# EAGLE design stageboy (EAGLE 6.5.0)
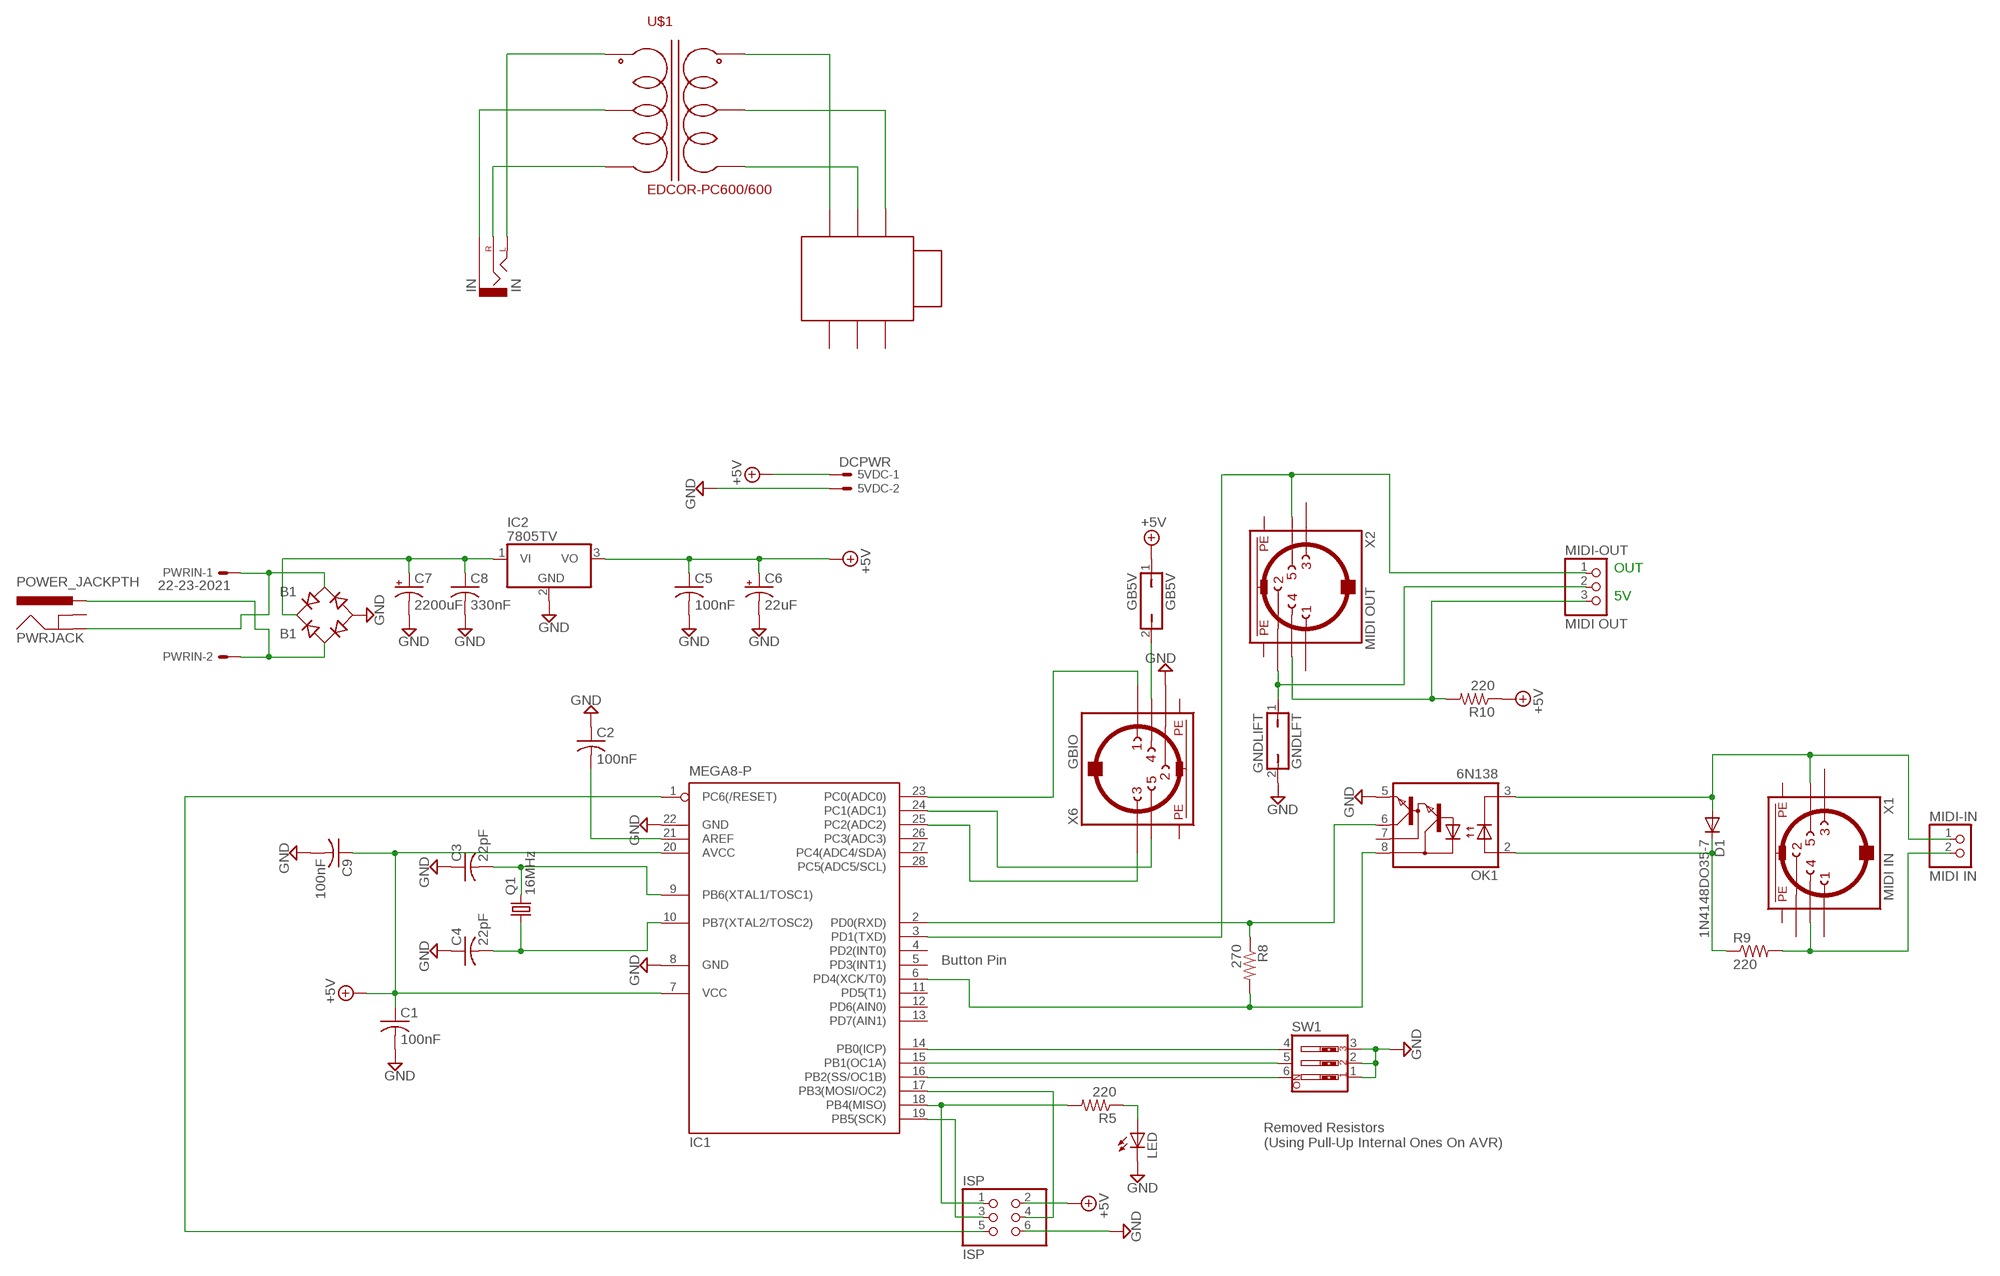
[diagram p0: schematic, sheet 1]

## Parts
5VDC  DCPWR  22-23-2021  [22-23-2021]
B1  B1  RB1A  [RB1A]
C1  100nF  C-US025-025X050  [C025-025X050]
C2  100nF  C-US025-025X050  [C025-025X050]
C3  22pF  C-US025-025X050  [C025-025X050]
C4  22pF  C-US025-025X050  [C025-025X050]
C5  100nF  C-US025-025X050  [C025-025X050]
C6  22uF  CPOL-USE2.5-5  [E2,5-5]
C7  2200uF  CPOL-USE5-13  [E5-13]
C8  330nF  C-US025-025X050  [C025-025X050]
C9  100nF  C-US025-025X050  [C025-025X050]
D1  1N4148DO35-7  [DO35-7]
GB5V  GB5V  JP1Q  [JP1]
GNDLFT  GNDLIFT  JP1Q  [JP1]
IC1  MEGA8-P  [DIL28-3]
IC2  7805TV  [TO220V]
IN  IN  AUDIO-JACKPTH  [AUDIO-JACK]
ISP  ISP  PINHD-2X3  [2X03]
LED  LED3MM  [LED3MM]
MIDI-IN  MIDI IN  PINHD-1X2  [1X02]
MIDI-OUT  MIDI OUT  PINHD-1X3  [1X03]
OK1  6N138  [DIL08]
OUT  NMJ6HFD2  [NMJ6HFD2]
PWRIN  22-23-2021  [22-23-2021]
PWRJACK  POWER_JACKPTH  [POWER_JACK_PTH]
Q1  16MHz  CRYSTALHC49S  [HC49/S]
R5  220  R-US_0204/7  [0204/7]
R8  270  R-US_0204/7  [0204/7]
R9  220  R-US_0204/7  [0204/7]
R10  220  R-US_0204/7  [0204/7]
SW1  SW_DIP-3  [EDG-03]
U$1  EDCOR-PC600/600  [PCW-12PIN]
X1  MIDI IN  MAB5SH  [MAB5SH]
X2  MIDI OUT  MAB5SH  [MAB5SH]
X6  GBIO  MAB5SH  [MAB5SH]

## Nets
+5V: 5VDC.1 C1.1 C5.1 C6.+ C9.1 GB5V.1 IC1.7(VCC) IC1.20(AVCC) IC2.3(VO) ISP.2 R10.1
GND: 5VDC.2 B1.- C1.2 C2.1 C3.1 C4.1 C5.2 C6.- C7.- C8.2 C9.2 GNDLFT.2 IC1.8(GND) IC1.22(GND) IC2.2(GND) ISP.6 LED.K(C) OK1.5(GND) SW1.1 SW1.2 SW1.3 X6.2
N$1: IC1.1(PC6(/RESET)) ISP.5
N$2: C2.2 IC1.21(AREF)
N$3: LED.A R5.1
N$4: IC1.14(PB0(ICP)) SW1.4
N$5: IC1.15(PB1(OC1A)) SW1.5
N$6: IC1.16(PB2(SS/OC1B)) SW1.6
N$10: IC1.6(PD4(XCK/T0)) OK1.8(VCC) R8.2
N$11: IC1.2(PD0(RXD)) OK1.6(VO) R8.1
N$12: D1.A MIDI-IN.1 OK1.3(C) X1.5
N$13: D1.C OK1.2(A) R9.1
N$16: MIDI-IN.2 R9.2 X1.4
N$17: IC1.17(PB3(MOSI/OC2)) ISP.4
N$18: IC1.18(PB4(MISO)) ISP.1 R5.2
N$19: IC1.19(PB5(SCK)) ISP.3
N$20: GB5V.2 X6.4
N$21: IC1.3(PD1(TXD)) MIDI-OUT.1 X2.5
N$22: C4.2 IC1.10(PB7(XTAL2/TOSC2)) Q1.1
N$23: IC1.25(PC2(ADC2)) X6.3
N$24: C3.2 IC1.9(PB6(XTAL1/TOSC1)) Q1.2
N$25: IC1.24(PC1(ADC1)) X6.5
N$26: IC1.23(PC0(ADC0)) X6.1
N$27: MIDI-OUT.3 R10.2 X2.4
N$28: B1.+ C7.+ C8.1 IC2.1(VI)
N$29: IN.TIP(LEFT) U$1.P$1
N$30: OUT.GND-IN U$1.P$8
N$32: OUT.LEFT-IN U$1.P$7
N$33: OUT.RIGHT-IN U$1.P$9
N$35: IN.SLEEVE U$1.P$2
N$38: B1.AC2 PWRIN.1 PWRJACK.GND
N$39: B1.AC1 PWRIN.2 PWRJACK.PWR
N$40: IN.RING(RIGHT) U$1.P$3
N$43: GNDLFT.1 MIDI-OUT.2 X2.2
Unconnected: IC1.4(PD2(INT0)) IC1.5(PD3(INT1)) IC1.11(PD5(T1)) IC1.12(PD6(AIN0)) IC1.13(PD7(AIN1)) IC1.26(PC3(ADC3)) IC1.27(PC4(ADC4/SDA)) IC1.28(PC5(ADC5/SCL)) OK1.7(VB) OUT.GND-OUT OUT.LEFT-OUT OUT.RIGHT-OUT PWRJACK.GNDBREAK X1.1 X1.2 X1.3 X2.1 X2.3

## Notes on the sheet
- OUT
- 5V
- Button Pin
- Removed Resistors
  (Using Pull-Up Internal Ones On AVR)

## Power pins joined to a net without a drawn wire
PE: X1.PE X1.PE@(PE) X2.PE X2.PE@(PE) X6.PE X6.PE@(PE)

## Library data of the parts
5VDC PWRIN = con-molex:22-23-2021: .100" (2.54mm) Center Header - 2 Pin; MF: MOLEX; MPN: 22-23-2021; OC_FARNELL: 1462926; OC_NEWARK: 25C3832
B1 = rectifier:RB1A: RECTIFIER 1 A
C1-C5 C8 C9 = rcl:C-US: CAPACITOR, American symbol
C6 C7 = resistor:CPOL-US: POLARIZED CAPACITOR, American symbol
D1 = diode:1N4148: DIODE high speed (Philips)
GB5V GNDLFT = jumper:JP1Q: JUMPER
IC1 = atmel:MEGA8-P: MICROCONTROLLER 8 Kbytes FLASH, 1 kbytes SRAM, 512 bytes EEPROM, USART, 4-channel 10 bit ADC, 2-channel 8 bit ADC Pin compatible with Atmega48, ATMega88, ATMega168 Source: avr.lbr; OC_FARNELL: unknown; OC_NEWARK: unknown
IC2 = linear:78*: Positive VOLTAGE REGULATOR Source: http://cache.national.com/ds/LM/LM78L05.pdf http://www.fairchildsemi.com/ds/LM/LM7805.pdf
IN = SparkFun:AUDIO-JACK: 3.5mm Audio Jack Simple 3.5mm common PCB mount audio jack. SKU: PRT-08032
ISP = pinhead:PINHD-2X3: PIN HEADER
LED = led:LED: LED OSRAM: - CHIPLED LG R971, LG N971, LY N971, LG Q971, LY Q971, LO R971, LY R971 LH N974, LH R974 LS Q976, LO Q976, LY Q976 LO Q996 - Hyper CHIPLED LW Q18S LB Q993, LB Q99A, LB R99A - SideLED LS A670, LO A670, LY A670, LG A670, LP A670 LB A673, LV A673, LT A673, LW A673 LH A674 LY A675 LS A676, LA A676, LO A676, LY A676, LW A676 LS A679, LY A679, LG A679 - Hyper Micro SIDELED® LS Y876, LA Y876, LO Y876, LY Y876 LT Y87S - SmartLED LW L88C, LW L88S LB L89C, LB L89S, LG L890 LS L89K, LO L89K, LY L89K LS L896, LA L896, LO L896, LY L896 - TOPLED LS T670, LO T670, LY T670, LG T670, LP T670 LSG T670, LSP T670, LSY T670, LOP T670, LYG T670 LG T671, LOG T671, LSG T671 LB T673, LV T673, LT T673, LW T673 LH T674 LS T676, LA T676, LO T676, LY T676, LB T676, LH T676, LSB T676, LW T676 LB T67C, LV T67C, LT T67C, LS T67K, LO T67K, LY T67K, LW E67C LS E67B, LA E67B, LO E67B, LY E67B, LB E67C, LV E67C, LT E67C LW T67C LS T679, LY T679, LG T679 LS T770, LO T770, LY T770, LG T770, LP T770 LB T773, LV T773, LT T773, LW T773 LH T774 LS E675, LA E675, LY E675, LS T675 LS T776, LA T776, LO T776, LY T776, LB T776 LHGB T686 LT T68C, LB T68C - Hyper Mini TOPLED® LB M676 - Mini TOPLED Santana® LG M470 LS M47K, LO M47K, LY M47K Source: http://www.osram.convergy.de LUXEON: - LUMILED® LXK2-PW12-R00, LXK2-PW12-S00, LXK2-PW14-U00, LXK2-PW14-V00 LXK2-PM12-R00, LXK2-PM12-S00, LXK2-PM14-U00 LXK2-PE12-Q00, LXK2-PE12-R00, LXK2-PE12-S00, LXK2-PE14-T00, LXK2-PE14-U00 LXK2-PB12-K00, LXK2-PB12-L00, LXK2-PB12-M00, LXK2-PB14-N00, LXK2-PB14-P00, LXK2-PB14-Q00 LXK2-PR12-L00, LXK2-PR12-M00, LXK2-PR14-Q00, LXK2-PR14-R00 LXK2-PD12-Q00, LXK2-PD12-R00, LXK2-PD12-S00 LXK2-PH12-R00, LXK2-PH12-S00 LXK2-PL12-P00, LXK2-PL12-Q00, LXK2-PL12-R00 Source: www.luxeon.com KINGBRIGHT: KA-3528ASYC Source: www.kingbright.com
MIDI-IN = pinhead:PINHD-1X2: PIN HEADER
MIDI-OUT = pinhead:PINHD-1X3: PIN HEADER
OK1 = optocoupler:6N138: MOTOROLA OPTO COUPLER; MF: VISHAY/TELEFUNKEN; MPN: 6N138; OC_FARNELL: 9860150; OC_NEWARK: 35K5294
OUT = Neutrik:NMJ6HFD2
PWRJACK = SparkFun-Connectors:POWER_JACK: Power Jack This is the standard 5.5mm barrel jack for power. The PTH is the most common, proven, reliable, footprint. The Slot footprint only works if the mill layer is transmitted to the PCB fab house so be warned. Spark Fun Electronics SKU : PRT-00119 SMT: CONN-08106 Mating wall wart : TOL-00298 (and others)
Q1 = crystal:CRYSTAL: CRYSTAL; OC_FARNELL: 1667008; OC_NEWARK: unknown
R5 R8-R10 = resistor:R-US_: RESISTOR, American symbol
SW1 = special:SW_DIP-3: DIP SWITCH
U$1 = EDCOR:EDCOR-PC600/600
X1 X2 X6 = con-hirschmann:MAB5SH: Female CONNECTOR 5 pins 90 deg. with shield, horizontal (DIN 41524); OC_FARNELL: 809883; OC_NEWARK: unknown

## Board
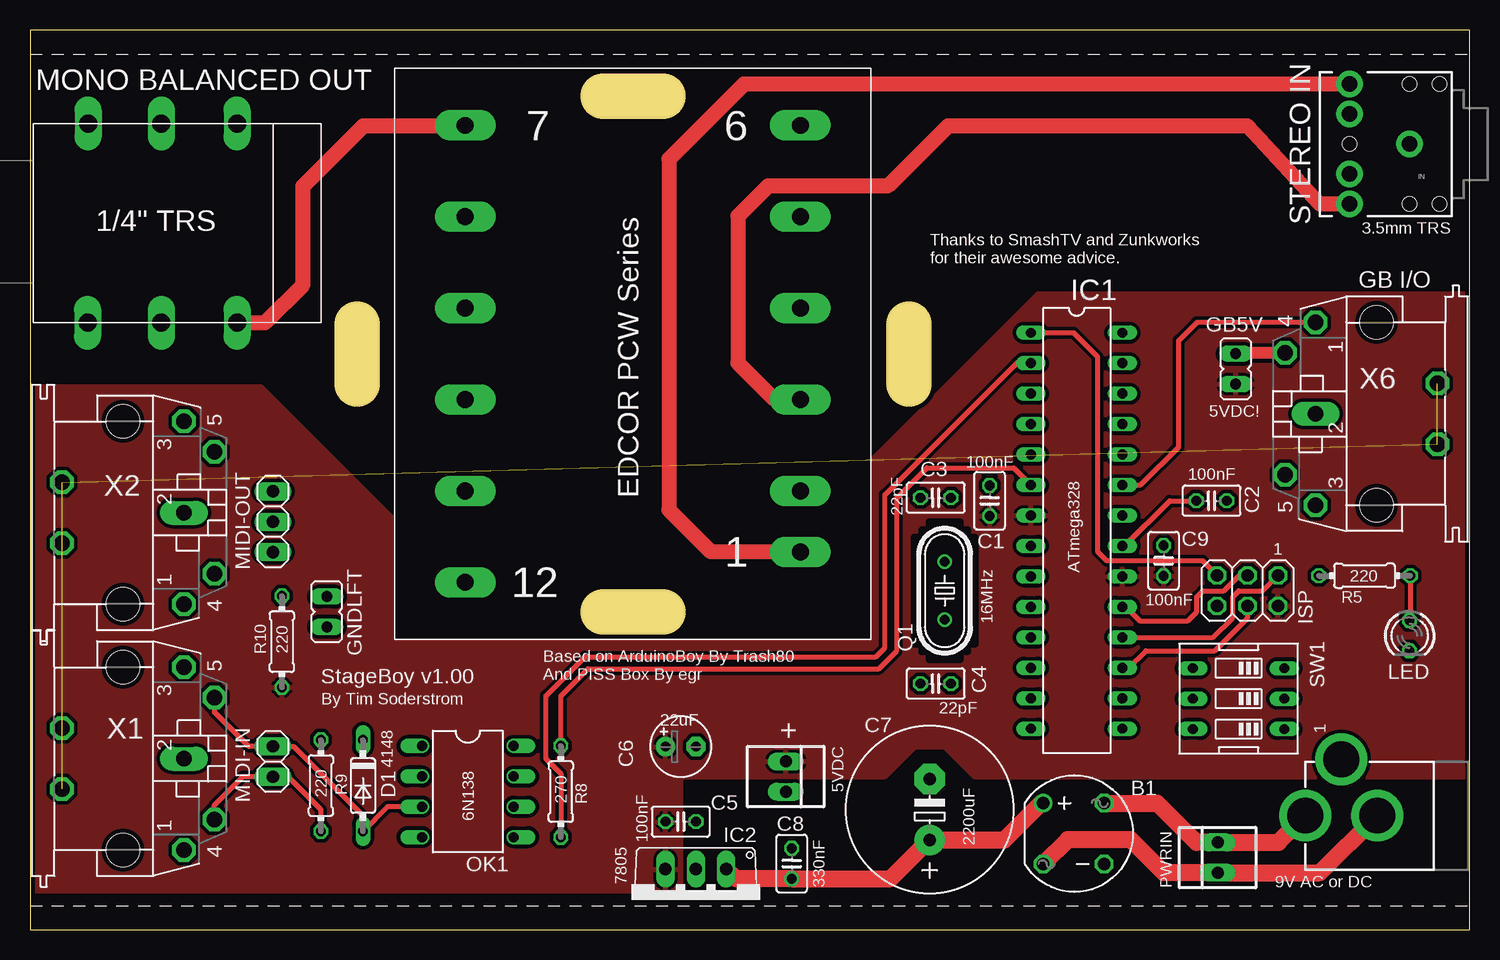
[diagram p1: board, top side]
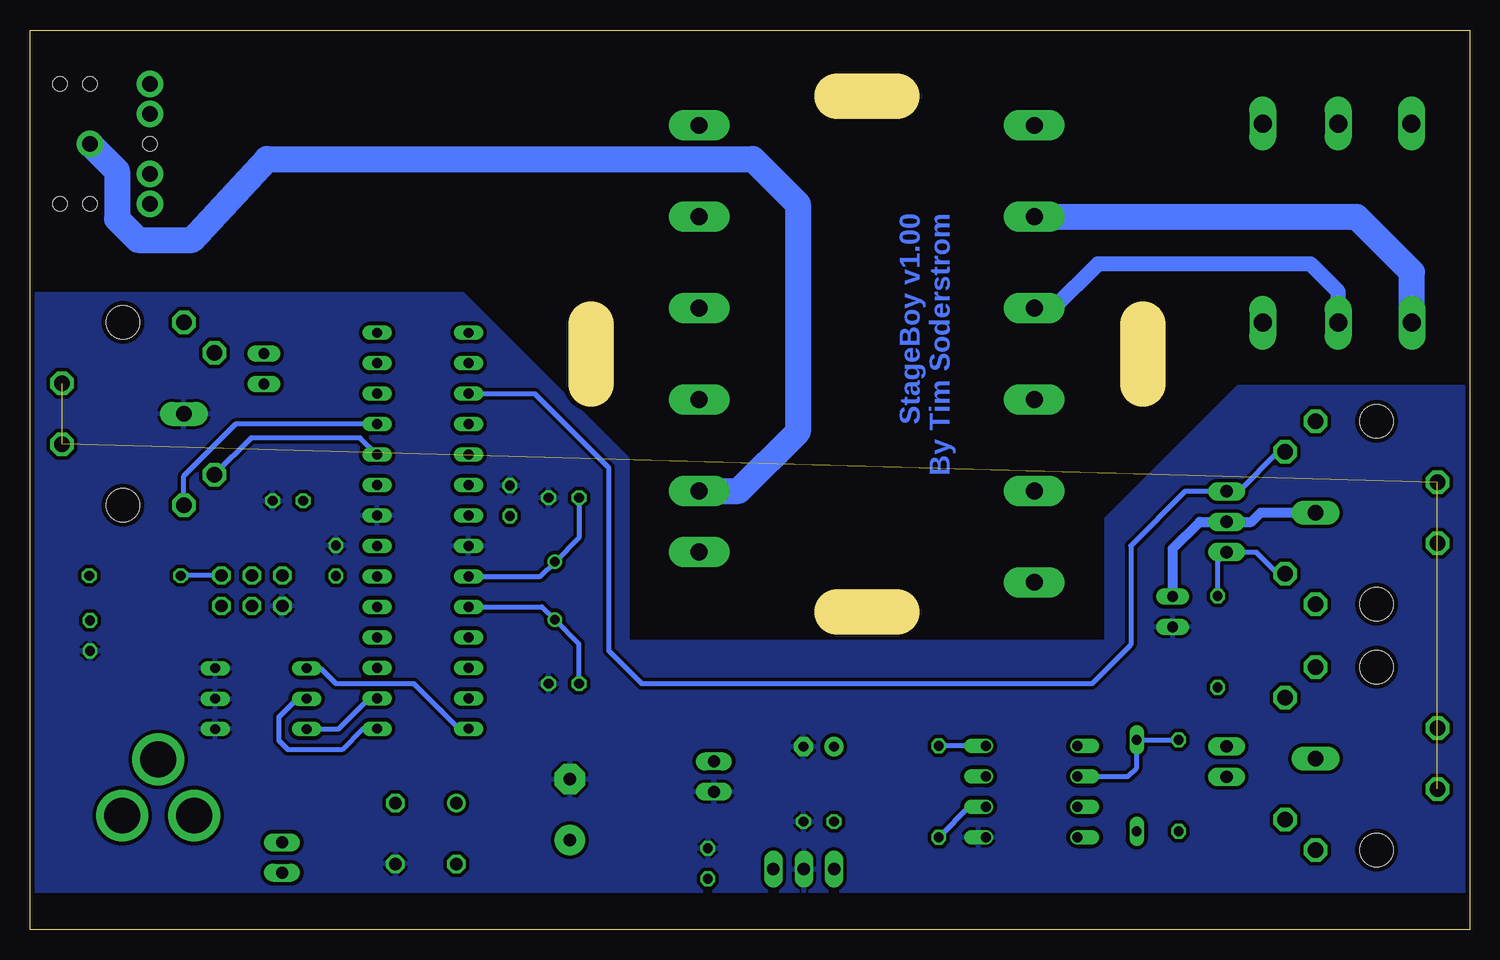
[diagram p2: board, bottom side, seen from below]

Size 120 x 75 mm. Coordinates in mm from the lower left corner, seen from the top.
Outline: 27.25,50.5 27.25,45.5
Outline: 52.75,69.5 47.75,69.5
Outline: 52.75,26.5 47.75,26.5
Outline: 73.25,45.5 73.25,50.5
Outline: 0,0 120,0 120,75 0,75 0,0
Copper layers (1*16): Top 0.0356mm / dielectric 1.5011mm / Bottom 0.0356mm
Design rules "LaenPCBOrder": minimum track width 6mil, minimum drill 13mil, track to track 6mil, track to pad 6mil, pad to pad 6mil, via to via 6mil, smd to smd 6mil, copper to edge 15mil, drill to drill 6mil, minimum pad ring 7mil, minimum via ring 7mil, stop-mask expansion 4mil, vias tented up to drill 0mil, thermal gap 10mil

### Footprints (pad centres in the part's own frame; a part is rotated, then mirrored left to right if it is on the bottom)
22-23-2021 = drill 1 long: 1 -1.27,0; 2 1.27,0
RB1A = drill 1.016: + -2.54,2.54 | drill 1.016 octagon: - 2.54,-2.54; AC1 2.54,2.54; AC2 -2.54,-2.54
C025-025X050 = drill 0.813 octagon: 1 -1.27,0; 2 1.27,0
E2,5-5 = drill 0.813 pad 1.6: + -1.27,0 | drill 0.813 pad 1.6 octagon: - 1.27,0
E5-13 = drill 1.016 pad 2.54: + -2.54,0 | drill 1.016 pad 2.54 octagon: - 2.54,0
DO35-7 = drill 0.813 long: A 3.81,0; C -3.81,0
JP1 = drill 0.914 long: 1 0,-1.27; 2 0,1.27
DIL28-3 = drill 0.813 long: 1 -16.51,-3.81; 2 -13.97,-3.81; 3 -11.43,-3.81; 4 -8.89,-3.81; 5 -6.35,-3.81; 6 -3.81,-3.81; 7 -1.27,-3.81; 8 1.27,-3.81; 9 3.81,-3.81; 10 6.35,-3.81; 11 8.89,-3.81; 12 11.43,-3.81; 13 13.97,-3.81; 14 16.51,-3.81; 15 16.51,3.81; 16 13.97,3.81; 17 11.43,3.81; 18 8.89,3.81; 19 6.35,3.81; 20 3.81,3.81; 21 1.27,3.81; 22 -1.27,3.81; 23 -3.81,3.81; 24 -6.35,3.81; 25 -8.89,3.81; 26 -11.43,3.81; 27 -13.97,3.81; 28 -16.51,3.81
TO220V = drill 1.016 long: 1 -2.54,-2.54; 2 0,-2.54; 3 2.54,-2.54
AUDIO-JACK = drill 1.3 pad 2.184: RING 5,5; RSH 5,2.5; SLEEVE 0,0; TIP 5,-5; TSH 5,-2.5 | hole 1.2: 0,5; -2.5,5; -2.5,-5; 0,-5; 5,0
2X03 = drill 1.016 octagon: 1 -2.54,-1.27; 2 -2.54,1.27; 3 0,-1.27; 4 0,1.27; 5 2.54,-1.27; 6 2.54,1.27
LED3MM = drill 0.813 octagon: A -1.27,0; K 1.27,0
1X02 = drill 1.016 long: 1 -1.27,0; 2 1.27,0
1X03 = drill 1.016 long: 1 -2.54,0; 2 0,0; 3 2.54,0
DIL08 = drill 0.813 offset: 1 -3.81,-3.81; 2 -1.27,-3.81; 3 1.27,-3.81; 4 3.81,-3.81; 5 3.81,3.81; 6 1.27,3.81; 7 -1.27,3.81; 8 -3.81,3.81
NMJ6HFD2 = drill 1.5 long: GND-IN -8.4,19.45; GND-OUT 8.2,19.4; LEFT-IN -8.4,7; LEFT-OUT 8.2,7; RIGHT-IN -8.4,13.3; RIGHT-OUT 8.2,13.3
POWER_JACK_PTH = drill 2.997 pad 4.318: GND 0,7.7; GNDBREAK 4.7,10.7; PWR 0,13.7
HC49/S = drill 0.813: 1 -2.413,0; 2 2.413,0
0204/7 = drill 0.813 octagon: 1 -3.81,0; 2 3.81,0
EDG-03 = drill 0.813 long: 1 -2.54,-3.81; 2 0,-3.81; 3 2.54,-3.81; 4 2.54,3.81; 5 0,3.81; 6 -2.54,3.81
PCW-12PIN = drill 1.4 pad 2.54 long: P$1 13.97,-16.51; P$2 13.97,-11.43; P$3 13.97,-3.81; P$4 13.97,3.81; P$5 13.97,11.43; P$6 13.97,19.05; P$7 -13.97,19.05; P$8 -13.97,11.43; P$9 -13.97,3.81; P$10 -13.97,-3.81; P$11 -13.97,-11.43; P$12 -13.97,-19.05
MAB5SH = drill 1.321 octagon: 1 7.62,5.08; 3 -7.62,5.08; 4 5.08,7.62; 5 -5.08,7.62; PE -2.54,-5.08; PE@ 2.54,-5.08 | drill 1.321 long: 2 0,5.08 | hole 2.794: 7.62,0; -7.62,0

### Placement (x,y rotation side)
5VDC  63,12.75 270 top
B1  87,8 0 top
C1  80,35.75 90 top
C2  98.5,35.75 180 top
C3  75.5,36 180 top
C4  75.5,20.5 180 top
C5  54.25,9 0 top
C6  54.25,15.25 0 top
C7  75,10 90 top
C8  63.5,5.5 90 top
C9  94.5,30.75 90 top
D1  27.75,12 270 top
GB5V  100.5,46.75 0 top
GNDLFT  24.75,26.5 180 top
IC1  87.25,33.25 270 top
IC2  55.5,2.5 180 top
IN  115,65.5 180 top
ISP  101.5,28.25 180 top
LED  115,24.5 270 top
MIDI-IN  20.25,14 270 top
MIDI-OUT  20.25,34 270 top
OK1  36.5,11.5 270 top
OUT  24.25,59 90 top
PWRIN  99,6 90 top
PWRJACK  120,9.5 90 top
Q1  76.25,28.25 90 top
R5  111.25,29.5 180 top
R8  44.25,11.5 90 top
R9  24.25,12 270 top
R10  21,24 90 top
SW1  100.75,19.25 90 top
U$1  50.25,48 0 top
X1  7.75,14.25 270 top
X2  7.75,34.75 270 top
X6  112.25,43 90 top

### Tracks (layer width: path | path; a pad name or v marks a point on that pad's centre or on a via)
+5V
  pour Top (isolate 0.305): 120,53 84,53 70.25,39.25 70.25,24 30.25,24 30.25,34.25 19.25,45.25 0.25,45.25 0.25,3.25 54.25,3.25 54.25,12.75 71.25,12.75 73.75,15.25 76.25,15.25 78.75,12.75 119.75,12.75
GND
  pour Bottom (isolate 0.305): 120,53 84,53 70.25,39.25 70.25,24 30.25,24 30.25,34.25 19.25,45.25 0,45.25 0,3.25 120,3.25
N$1
  Top 0.406: IC1.1 86.99,49.76 89,47.75 89,31.5 89.75,30.75 97.75,30.75 98.98,29.52 ISP.5
N$2
  Top 0.406: IC1.21 91.23,31.98 95,35.75 C2.2
N$3
  Top 0.406: R5.1 115.06,25.83 LED.A
N$4
  Bottom 0.406: IC1.14 84.24,16.74 88,20.5 94.5,20.5 95.75,21.75 96.9,21.75 SW1.4
N$5
  Bottom 0.406: IC1.15 92.26,16.74 94,15 98.5,15 99.25,15.75 99.25,17.75 97.75,19.25 SW1.5
N$6
  Bottom 0.406: IC1.16 91.72,19.28 94.29,16.71 SW1.6
N$10
  Top 0.406: R8.2 44.25,19.5 46.5,21.75 70.75,21.75 72.25,23.25 72.25,36 74.75,38.5 82,38.5 IC1.6
  Bottom 0.406: OK1.8 R8.2
N$11
  Top 0.406: IC1.2 83.41,47.25 82.25,47.25 71.25,36.25 71.25,23.5 70.5,22.75 46.25,22.75 43,19.5 43,14.25 44.25,13 R8.1
  Bottom 0.406: OK1.6 41.71,10.23 R8.1
N$12
  Top 0.406: X1.5 15.37,18.13 18.23,15.27 MIDI-IN.1 21.98,15.27 27.75,9.5 D1.A 29.79,10.23 OK1.3
N$13
  Bottom 0.406: OK1.2 28.48,12.77 27.75,13.5 D1.C R9.1
N$16
  Top 0.406: X1.4 15.37,10.37 17.73,12.73 MIDI-IN.2 21.52,12.73 24.25,10 R9.2
N$17
  Top 0.406: IC1.17 91.57,21.82 93,23.25 98.75,23.25 101.5,26 ISP.4
N$18
  Top 0.406: IC1.18 98.61,24.36 100.25,26 100.25,27.75 100.75,28.25 102.77,28.25 ISP.1
  Bottom 0.406: ISP.1 107.42,29.52 R5.2
N$19
  Top 0.406: IC1.19 91.35,26.9 92.5,25.75 96.5,25.75 97.25,26.5 97.25,27.75 97.75,28.25 99.5,28.25 100.75,29.5 101.48,29.5 ISP.3
N$20
  Top 1.016: X6.4 100.56,48.08 GB5V.2
N$21
  Bottom 0.406: X2.5 15.96,39.83 19.25,36.54 MIDI-OUT.1 23.71,36.54 28.25,32 28.25,23.75 31.5,20.5 69,20.5 71.75,23.25 71.75,38.5 77.93,44.68 IC1.3
N$22
  Bottom 0.406: IC1.10 77.31,26.9 Q1.1 74.23,23.82 C4.2
N$23
  Top 0.406: X6.3 107.13,35.38
  Bottom 0.406: IC1.25 102.86,42.14 107.17,37.83 X6.3
N$24
  Bottom 0.406: IC1.9 77.47,29.44 Q1.2 74.23,32.68 C3.2
N$25
  Bottom 0.406: X6.5 101.55,41 92.46,41 IC1.24
N$26
  Top 0.406: X6.1 97.25,50.62 95.75,49.12 95.75,40.25 92.56,37.06 IC1.23
N$27
  Bottom 0.406: X2.4 16.02,29.67 17.81,31.46 MIDI-OUT.3 21,30.71 R10.2
N$28
  Top 1.422: IC2.1 58.85,4.23 C8.1 71.73,4.23 74.96,7.46 C7.+ 81.21,7.46 84.29,10.54 B1.+
N$29
  Top 1.27: IN.TIP 59.5,70.5 53.25,64.25 53.25,35 56.76,31.49 U$1.P$1
N$30
  Bottom 2.184: OUT.GND-IN 4.8,54.8 9.12,59.12 9.25,59.25 9.43,59.43 U$1.P$8
N$32
  Top 1.27: U$1.P$7 36.23,67 27.75,67 22.75,62 22.75,53.75 19.6,50.6 OUT.LEFT-IN
N$33
  Bottom 1.27: OUT.RIGHT-IN 10.95,53.2 13.25,55.5 31,55.5 34.69,51.81 U$1.P$9
N$35
  Bottom 2.184: IN.SLEEVE 112.75,63.25 112.75,59.25 111,57.5 106.5,57.5 100.25,64.25 59.75,64.25 56,60.5 56,41.5 60.93,36.57 U$1.P$2
N$38
  Top 1.422: B1.AC2 86.5,7.5 91.75,7.5 94.52,4.73 PWRIN.1 107.53,4.73 PWRJACK.GND
N$39
  Top 1.422: B1.AC1 93.96,10.54 97.23,7.27 PWRIN.2 104.07,7.27 PWRJACK.PWR
N$40
  Top 1.27: IN.RING 107.5,60.5 101.5,67 76.5,67 71.5,62 61.5,62 59,59.5 59,47.25 62,44.25 64.16,44.25 U$1.P$3
N$43
  Bottom 0.813: GNDLFT.1 24.73,31.77 22.5,34 MIDI-OUT.2 18.17,34 17.42,34.75 X2.2
PE  (5 unrouted)

### Text on the board
Bottom: StageBoy v1.00 / By Tim Soderstrom
tNames: MONO BALANCED OUT | 1/4" TRS | STEREO IN | 3.5mm TRS | Thanks to SmashTV and Zunkworks / for their awesome advice. | GB I/O | 5VDC! | 100nF | 100nF | EDCOR PCW Series | 22pF | 1 | ATmega328 | 220 | 100nF | 16MHz | 220 | StageBoy v1.00 | By Tim Soderstrom | Based on ArduinoBoy By Trash80 / And PISS Box By egr | 22uF | 22pF | 1 | + | 4148 | 6N138 | 220 | 270 | 100nF | 2200uF | 7805 | 330nF | 9V AC or DC